# EAGLE design IBUS_adapter (EAGLE 6.4)
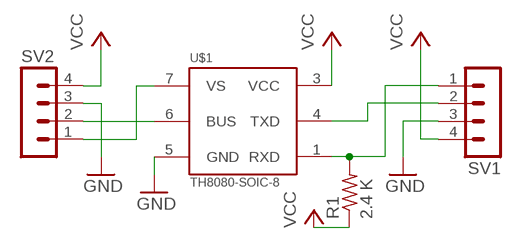
[diagram p0: schematic, sheet 1]

## Parts
R1  2.4 K  R-US_R1206  [R1206]
SV1  MA04-1  [MA04-1]
SV2  MA04-1  [MA04-1]
U$1  TH8080-SOIC-8  [SO-8]

## Nets
GND: SV1.3 SV2.3 U$1.5(GND)
N$1: R1.2 SV1.1 U$1.1(RXD)
N$2: SV1.2 U$1.4(TXD)
N$3: SV2.2 U$1.6(BUS)
N$4: SV2.1 U$1.7(VS)
VCC: R1.1 SV1.4 SV2.4 U$1.3(VCC)

## Library data of the parts
R1 = rcl:R-US_: RESISTOR, American symbol
SV1 SV2 = con-lstb:MA04-1: PIN HEADER; OC_FARNELL: unknown; OC_NEWARK: unknown
U$1 = TH-8080:TH8080-SOIC-8

## Board
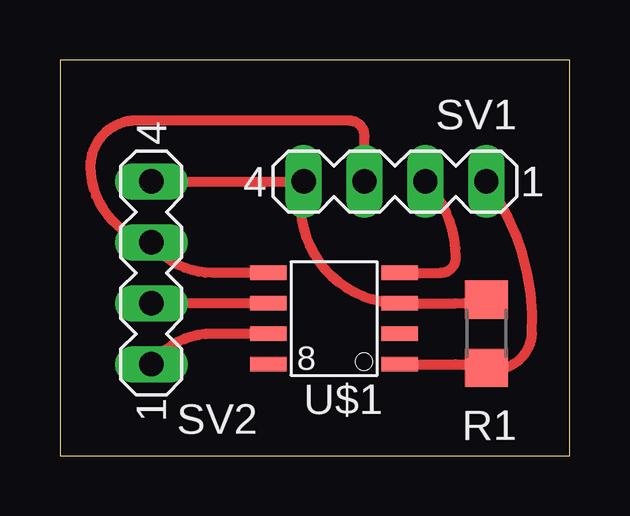
[diagram p1: board, top side]

Size 21.26 x 16.5 mm. Coordinates in mm from the lower left corner, seen from the top.
Outline: 0,0 21.26,0 21.26,16.5 0,16.5 0,0
Copper layers (1*16): Top 0.035mm / dielectric 1.5mm / Bottom 0.035mm
Design rules "default": minimum track width 10mil, minimum drill 24mil, track to track 8mil, track to pad 8mil, pad to pad 8mil, via to via 8mil, smd to smd 8mil, copper to edge 40mil, drill to drill 8mil, minimum pad ring 10mil, minimum via ring 8mil, stop-mask expansion 4mil, vias tented up to drill 0mil, thermal gap 10mil

### Footprints (pad centres in the part's own frame; a part is rotated, then mirrored left to right if it is on the bottom)
R1206 = smd 1.6 x 1.803: 1 -1.422,0; 2 1.422,0
MA04-1 = drill 1.016 long: 1 -3.81,0; 2 -1.27,0; 3 1.27,0; 4 3.81,0
SO-8 = smd 1.524 x 0.61: 1 -2.743,1.27; 2 -2.743,0; 3 -2.743,-1.27; 4 -2.743,-2.54; 5 2.743,-2.54; 6 2.743,-1.27; 7 2.743,0; 8 2.743,1.27

### Placement (x,y rotation side)
R1  17.78,5.08 270 top
SV1  13.97,11.43 180 top
SV2  3.81,7.62 90 top
U$1  11.43,5.08 180 top

### Tracks (layer width: path | path; a pad name or v marks a point on that pad's centre or on a via)
GND
  Top 0.406: U$1.5 6.35,7.62 arc-53 SV2.3 arc-77 1.27,12.06 arc-90 3.17,13.97 12.06,13.97 arc-90 12.7,13.34 SV1.3
N$1
  Top 0.406: U$1.1 16.51,3.81 arc-14 R1.2 arc101 19.68,5.08 arc39 SV1.1
N$2
  Top 0.406: U$1.4 15.88,7.62 arc90 16.51,8.26 arc44 SV1.2
N$3
  Top 0.406: U$1.6 SV2.2
N$4
  Top 0.406: U$1.7 6.35,5.08 arc53 SV2.1
VCC
  Top 0.406: SV2.4 SV1.4 arc103 U$1.3 16.51,6.35 arc14 R1.1